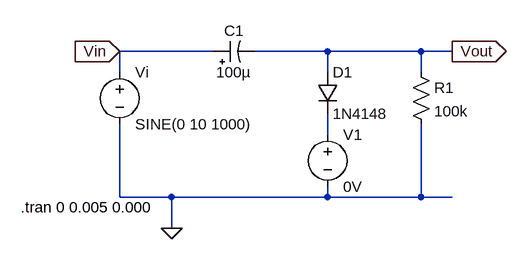
[diagram p0: schematic P-2.asc]
P-2.asc, the LTspice schematic file:
Version 4
SHEET 1 880 680
WIRE 112 112 -32 112
WIRE 288 112 176 112
WIRE 432 112 288 112
WIRE 480 112 432 112
WIRE -32 144 -32 112
WIRE 288 144 288 112
WIRE 432 144 432 112
WIRE 288 240 288 208
WIRE -32 336 -32 224
WIRE 48 336 -32 336
WIRE 288 336 288 320
WIRE 288 336 48 336
WIRE 432 336 432 224
WIRE 432 336 288 336
WIRE 480 336 432 336
WIRE 48 384 48 336
FLAG 480 112 Vout
IOPIN 480 112 Out
FLAG -32 112 Vin
IOPIN -32 112 In
FLAG 48 384 0
SYMBOL voltage -32 128 R0
WINDOW 123 24 124 Left 2
WINDOW 39 0 0 Left 0
SYMATTR InstName Vi
SYMATTR Value SINE(0 10 1000)
SYMBOL diode 272 144 R0
SYMATTR InstName D1
SYMATTR Value 1N4148
SYMBOL res 416 128 R0
SYMATTR InstName R1
SYMATTR Value 100k
SYMBOL voltage 288 224 R0
WINDOW 123 0 0 Left 0
WINDOW 39 0 0 Left 0
SYMATTR InstName V1
SYMATTR Value 0V
SYMBOL polcap 112 128 R270
WINDOW 0 32 32 VTop 2
WINDOW 3 0 32 VBottom 2
SYMATTR InstName C1
SYMATTR Value 100µ
TEXT -184 352 Left 2 !.tran 0 0.005 0.000

The netlist it stands for:
* P-2.asc
Vi Vin 0 SINE(0 10 1000)
D1 Vout N001 1N4148
R1 Vout 0 100k
V1 N001 0 0V
C1 Vin Vout 100µ
.model D D
.lib standard.dio
.tran 0 0.005 0.000
.backanno
.end

* Results of the author's LTspice run, read from the files saved beside the schematic
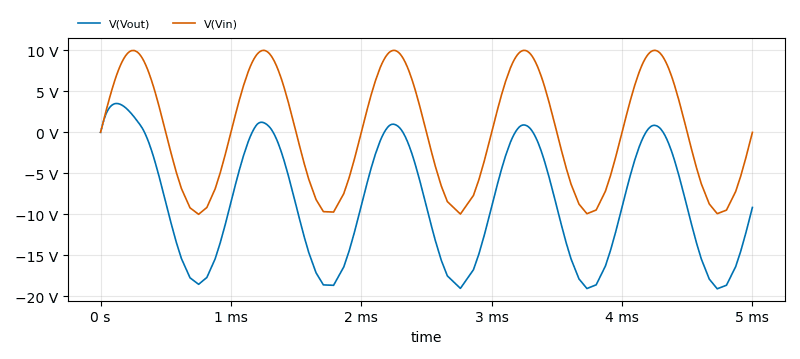
[diagram p1: Transient Analysis of P-2.asc, plotted from the saved traces]
* Transient Analysis, 1 run:
*   V(Vout): min -19.08 V, max 3.519 V, average -8.643 V, rms 11.34 V, last -9.161 V
*   V(Vin): min -9.997 V, max 9.997 V, average 42.44 mV, rms 7.038 V, last 0 V